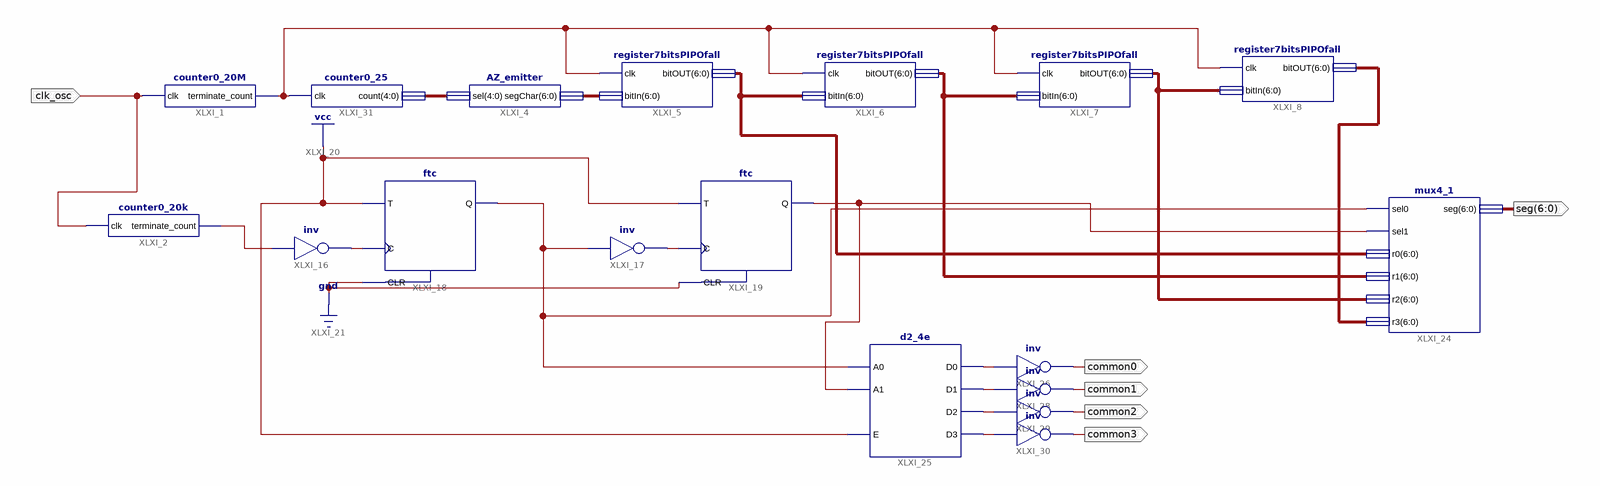
[diagram p0: schematic sheet 1]
// Xilinx ISE schematic top.sch (spartan6) as structural Verilog: 18 symbols, 6 ports
module top (
  input  clk_osc,
  output [6:0] seg,
  output common0,
  output common1,
  output common2,
  output common3
);

  wire XLXN_21, XLXN_24, XLXN_28, XLXN_29, XLXN_31, XLXN_38, XLXN_39, XLXN_40, XLXN_41, XLXN_42;
  wire [4:0] XLXN_43;
  wire [6:0] XLXN_3, XLXN_4, XLXN_32, XLXN_33, XLXN_34;

  counter0_20M XLXI_1 (.clk(clk_osc), .terminate_count(XLXN_21));
  counter0_20k XLXI_2 (.clk(clk_osc), .terminate_count(XLXN_29));
  AZ_emitter XLXI_4 (.sel(XLXN_43), .segChar(XLXN_3));
  register7bitsPIPOfall XLXI_5 (.clk(XLXN_21), .bitIn(XLXN_3), .bitOUT(XLXN_4));
  register7bitsPIPOfall XLXI_6 (.clk(XLXN_21), .bitIn(XLXN_4), .bitOUT(XLXN_32));
  register7bitsPIPOfall XLXI_8 (.clk(XLXN_21), .bitIn(XLXN_33), .bitOUT(XLXN_34));
  register7bitsPIPOfall XLXI_7 (.clk(XLXN_21), .bitIn(XLXN_32), .bitOUT(XLXN_33));
  not XLXI_16 (XLXN_28, XLXN_29);
  ftc XLXI_18 (.C(XLXN_28), .CLR(1'b0), .T(1'b1), .Q(XLXN_31));
  ftc XLXI_19 (.C(XLXN_24), .CLR(1'b0), .T(1'b1), .Q(XLXN_38));
  not XLXI_17 (XLXN_24, XLXN_31);
  mux4_1 XLXI_24 (.sel0(XLXN_31), .sel1(XLXN_38), .r0(XLXN_4), .r1(XLXN_32), .r2(XLXN_33), .r3(XLXN_34), .seg(seg));
  d2_4e XLXI_25 (.A0(XLXN_31), .A1(XLXN_38), .E(1'b1), .D0(XLXN_39), .D1(XLXN_40), .D2(XLXN_41), .D3(XLXN_42));
  not XLXI_26 (common0, XLXN_39);
  not XLXI_28 (common1, XLXN_40);
  not XLXI_29 (common2, XLXN_41);
  not XLXI_30 (common3, XLXN_42);
  counter0_25 XLXI_31 (.clk(XLXN_21), .count(XLXN_43));
endmodule
